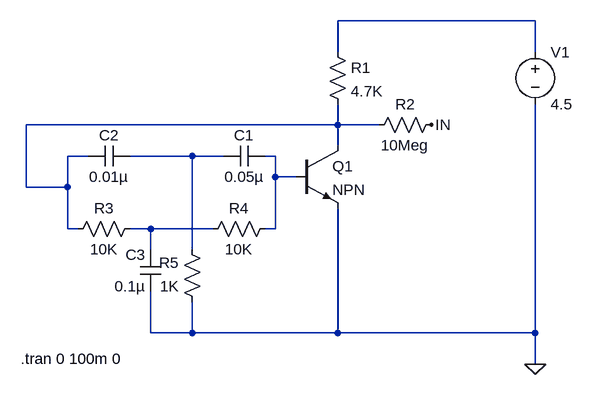
[diagram p0: schematic No.25.asc]
No.25.asc, the LTspice schematic file:
Version 4
SHEET 1 960 680
WIRE 896 48 592 48
WIRE 592 96 592 48
WIRE 896 96 896 48
WIRE 592 208 592 176
WIRE 592 208 112 208
WIRE 656 208 592 208
WIRE 592 240 592 208
WIRE 208 256 176 256
WIRE 368 256 272 256
WIRE 416 256 368 256
WIRE 496 256 480 256
WIRE 496 288 496 256
WIRE 528 288 496 288
WIRE 112 304 112 208
WIRE 176 304 176 256
WIRE 176 304 112 304
WIRE 176 368 176 304
WIRE 192 368 176 368
WIRE 304 368 272 368
WIRE 400 368 304 368
WIRE 496 368 496 288
WIRE 496 368 480 368
WIRE 304 400 304 368
WIRE 368 400 368 256
WIRE 304 528 304 464
WIRE 368 528 368 480
WIRE 368 528 304 528
WIRE 592 528 592 336
WIRE 592 528 368 528
WIRE 896 528 896 176
WIRE 896 528 592 528
WIRE 896 576 896 528
FLAG 896 576 0
FLAG 736 208 IN
SYMBOL npn 528 240 R0
SYMATTR InstName Q1
SYMBOL res 576 80 R0
SYMATTR InstName R1
SYMATTR Value 4.7K
SYMBOL res 752 192 R90
WINDOW 0 0 56 VBottom 2
WINDOW 3 32 56 VTop 2
SYMATTR InstName R2
SYMATTR Value 10Meg
SYMBOL res 288 352 R90
WINDOW 0 0 56 VBottom 2
WINDOW 3 32 56 VTop 2
SYMATTR InstName R3
SYMATTR Value 10K
SYMBOL res 496 352 R90
WINDOW 0 0 56 VBottom 2
WINDOW 3 32 56 VTop 2
SYMATTR InstName R4
SYMATTR Value 10K
SYMBOL res 384 496 R180
WINDOW 0 36 76 Left 2
WINDOW 3 36 40 Left 2
SYMATTR InstName R5
SYMATTR Value 1K
SYMBOL cap 480 240 R90
WINDOW 0 0 32 VBottom 2
WINDOW 3 32 32 VTop 2
SYMATTR InstName C1
SYMATTR Value 0.05µ
SYMBOL cap 272 240 R90
WINDOW 0 0 32 VBottom 2
WINDOW 3 32 32 VTop 2
SYMATTR InstName C2
SYMATTR Value 0.01µ
SYMBOL cap 320 464 R180
WINDOW 0 24 56 Left 2
WINDOW 3 24 8 Left 2
SYMATTR InstName C3
SYMATTR Value 0.1µ
SYMBOL voltage 896 80 R0
SYMATTR InstName V1
SYMATTR Value 4.5
TEXT 104 568 Left 2 !.tran 0 100m 0

The netlist it stands for:
* No.25.asc
Q1 N002 N004 0 0 NPN
R1 N001 N002 4.7K
R2 IN N002 10Meg
R3 N005 N002 10K
R4 N004 N005 10K
R5 0 N003 1K
C1 N004 N003 0.05µ
C2 N003 N002 0.01µ
C3 0 N005 0.1µ
V1 N001 0 4.5
.model NPN NPN
.model PNP PNP
.lib standard.bjt
.tran 0 100m 0
.backanno
.end